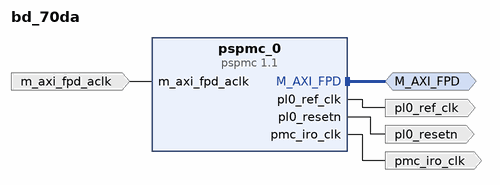
[diagram p0: block diagram of the top level]
# Vivado block design bd_70da, xcvm1802-vsva2197-2MP-e-S, Vivado 2021.2
create_bd_design bd_70da

create_bd_intf_port -mode Master -vlnv xilinx.com:interface:aximm_rtl:1.0 M_AXI_FPD
create_bd_port -dir O -type clk pl0_ref_clk
set_property -dict {CONFIG.FREQ_HZ 99999001} [get_bd_ports pl0_ref_clk]
create_bd_port -dir O -type clk pmc_iro_clk
set_property -dict {CONFIG.FREQ_HZ 400000000} [get_bd_ports pmc_iro_clk]
create_bd_port -dir O -type rst pl0_resetn
create_bd_port -dir I -type clk m_axi_fpd_aclk

create_bd_cell -type ip -vlnv xilinx.com:ip:pspmc:1.1 pspmc_0
